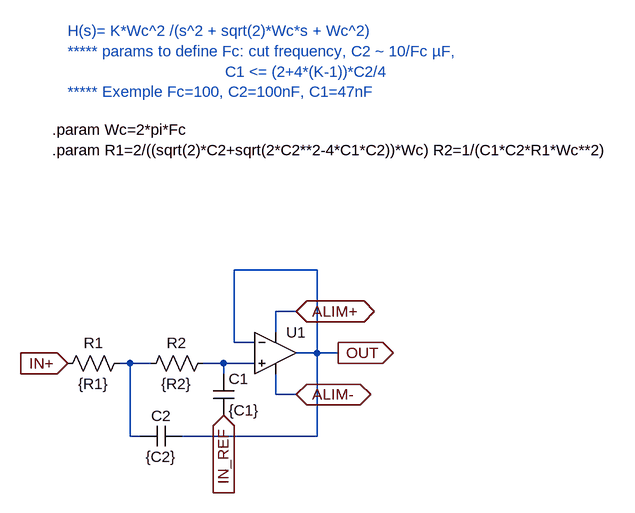
[diagram p0: schematic VCVS-LowPass-ButterworthNoGain-SUB.asc]
VCVS-LowPass-ButterworthNoGain-SUB.asc, the LTspice schematic file:
Version 4
SHEET 1 1032 680
WIRE 288 48 160 48
WIRE 256 112 224 112
WIRE 224 144 224 112
WIRE 160 160 160 48
WIRE 192 160 160 160
WIRE 288 176 288 48
WIRE 288 176 256 176
WIRE 320 176 288 176
WIRE 0 192 -16 192
WIRE 32 192 0 192
WIRE 144 192 112 192
WIRE 192 192 144 192
WIRE 144 208 144 192
WIRE 224 240 224 208
WIRE 256 240 224 240
WIRE 0 304 0 192
WIRE 16 304 0 304
WIRE 288 304 288 176
WIRE 288 304 80 304
FLAG 256 112 ALIM+
IOPIN 256 112 BiDir
FLAG 256 240 ALIM-
IOPIN 256 240 BiDir
FLAG 320 176 OUT
IOPIN 320 176 Out
FLAG 144 272 IN_REF
IOPIN 144 272 In
FLAG -96 192 IN+
IOPIN -96 192 In
SYMBOL Opamps\\UniversalOpamp2 224 176 R0
SYMATTR InstName U1
SYMBOL res 0 176 R90
WINDOW 0 0 56 VBottom 2
WINDOW 3 32 56 VTop 2
SYMATTR InstName R1
SYMATTR Value {R1}
SYMBOL res 128 176 R90
WINDOW 0 0 56 VBottom 2
WINDOW 3 32 56 VTop 2
SYMATTR InstName R2
SYMATTR Value {R2}
SYMBOL cap 128 208 R0
SYMATTR InstName C1
SYMATTR Value {C1}
SYMBOL cap 80 288 R90
WINDOW 0 0 32 VBottom 2
WINDOW 3 32 32 VTop 2
SYMATTR InstName C2
SYMATTR Value {C2}
TEXT -96 -320 Left 2 ;H(s)= K*Wc^2 /(s^2 + sqrt(2)*Wc*s + Wc^2)\n***** params to define Fc: cut frequency, C2 ~ 10/Fc µF, \n                                   C1 <= (2+4*(K-1))*C2/4\n***** Exemple Fc=100, C2=100nF, C1=47nF
TEXT -120 -168 Left 2 !.param Wc=2*pi*Fc\n.param R1=2/((sqrt(2)*C2+sqrt(2*C2**2-4*C1*C2))*Wc) R2=1/(C1*C2*R1*Wc**2)

The netlist it stands for:
* VCVS-LowPass-ButterworthNoGain-SUB.asc
XU1 N002 OUT ALIM+ ALIM- OUT level.2 Avol=1Meg GBW=10Meg Slew=10Meg ilimit=25m rail=0 Vos=0 phimargin=45 en=0 enk=0 in=0 ink=0 Rin=500Meg  ; pins IN+ IN- V+ V- OUT
R1 N001 IN+ {R1}
R2 N002 N001 {R2}
C1 N002 IN_REF {C1}
C2 OUT N001 {C2}
* H(s)= K*Wc^2 /(s^2 + sqrt(2)*Wc*s + Wc^2)
* ***** params to define Fc: cut frequency, C2 ~ 10/Fc µF,
*                                    C1 <= (2+4*(K-1))*C2/4
* ***** Exemple Fc=100, C2=100nF, C1=47nF
.param Wc=2*pi*Fc
.param R1=2/((sqrt(2)*C2+sqrt(2*C2**2-4*C1*C2))*Wc) R2=1/(C1*C2*R1*Wc**2)
.lib UniversalOpamps2.sub
.backanno
.end